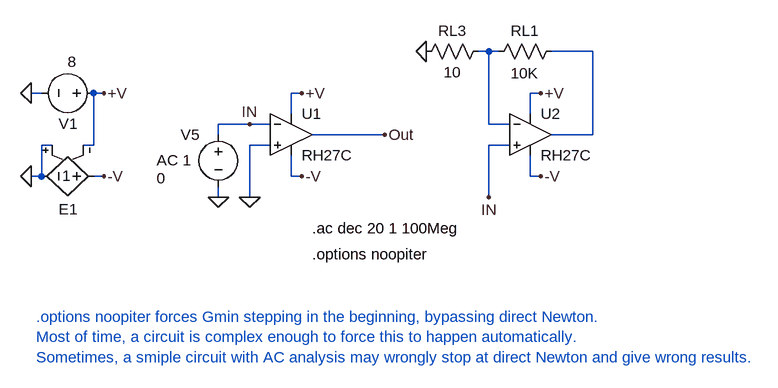
[diagram p0: schematic RH27C_AC_Sim.asc]
RH27C_AC_Sim.asc, the LTspice schematic file:
Version 4
SHEET 1 2812 688
WIRE 1888 112 1872 112
WIRE 1904 112 1888 112
WIRE 2048 112 1984 112
WIRE 1200 176 1184 176
WIRE 1296 176 1280 176
WIRE 1600 176 1584 176
WIRE 1968 176 1952 176
WIRE 1584 208 1584 176
WIRE 1952 208 1952 176
WIRE 1520 224 1472 224
WIRE 1552 224 1520 224
WIRE 1888 224 1888 112
WIRE 1920 224 1888 224
WIRE 1472 240 1472 224
WIRE 1728 240 1616 240
WIRE 2048 240 2048 112
WIRE 2048 240 1984 240
WIRE 1216 256 1200 256
WIRE 1280 256 1280 176
WIRE 1280 256 1264 256
WIRE 1552 256 1520 256
WIRE 1920 256 1888 256
WIRE 1200 304 1200 256
WIRE 1200 304 1184 304
WIRE 1296 304 1280 304
WIRE 1584 304 1584 272
WIRE 1600 304 1584 304
WIRE 1952 304 1952 272
WIRE 1968 304 1952 304
WIRE 1472 336 1472 320
WIRE 1520 336 1520 256
WIRE 1888 336 1888 256
FLAG 1184 176 0
FLAG 1184 304 0
FLAG 1472 336 0
FLAG 1600 176 +V
FLAG 1600 304 -V
FLAG 1520 336 0
FLAG 1728 240 Out
FLAG 1296 176 +V
FLAG 1296 304 -V
FLAG 1520 224 IN
FLAG 1968 176 +V
FLAG 1968 304 -V
FLAG 1792 112 0
FLAG 1888 336 IN
SYMBOL voltage 1296 176 R90
WINDOW 123 0 0 Left 2
WINDOW 39 0 0 Left 2
WINDOW 0 47 40 VRight 2
WINDOW 3 -48 42 VRight 2
SYMATTR InstName V1
SYMATTR Value 8
SYMBOL voltage 1472 224 R0
WINDOW 0 -58 16 Left 2
WINDOW 3 -95 83 Left 2
WINDOW 123 -95 55 Left 2
WINDOW 39 0 0 Left 2
SYMATTR InstName V5
SYMATTR Value 0
SYMATTR Value2 AC 1
SYMBOL e2 1296 304 R90
WINDOW 0 51 40 VRight 2
WINDOW 3 -1 51 VRight 2
SYMATTR InstName E1
SYMATTR Value 1
SYMBOL Opamps\\RH27C 1584 176 R0
SYMATTR InstName U1
SYMBOL Opamps\\RH27C 1952 176 R0
SYMATTR InstName U2
SYMBOL res 2000 96 R90
WINDOW 0 0 56 VBottom 2
WINDOW 3 34 57 VTop 2
SYMATTR InstName RL1
SYMATTR Value 10K
SYMBOL res 1888 96 R90
WINDOW 0 0 56 VBottom 2
WINDOW 3 32 56 VTop 2
SYMATTR InstName RL3
SYMATTR Value 10
TEXT 1616 384 Left 2 !.ac dec 20 1 100Meg
TEXT 1616 424 Left 2 !.options noopiter
TEXT 1192 520 Left 2 ;.options noopiter forces Gmin stepping in the beginning, bypassing direct Newton.\nMost of time, a circuit is complex enough to force this to happen automatically.\nSometimes, a smiple circuit with AC analysis may wrongly stop at direct Newton and give wrong results.

The netlist it stands for:
* RH27C_AC_Sim.asc
V1 +V 0 8
V5 IN 0 0 AC 1
E1 -V 0 0 +V 1
XU1 0 IN +V -V Out RH27C  ; pins In+ In- V+ V- OUT
XU2 IN N001 +V -V N002 RH27C  ; pins In+ In- V+ V- OUT
RL1 N002 N001 10K
RL3 N001 0 10
.ac dec 20 1 100Meg
.options noopiter
* .options noopiter forces Gmin stepping in the beginning, bypassing direct Newton.
* Most of time, a circuit is complex enough to force this to happen automatically.
* Sometimes, a smiple circuit with AC analysis may wrongly stop at direct Newton and give wrong results.
.backanno
.end